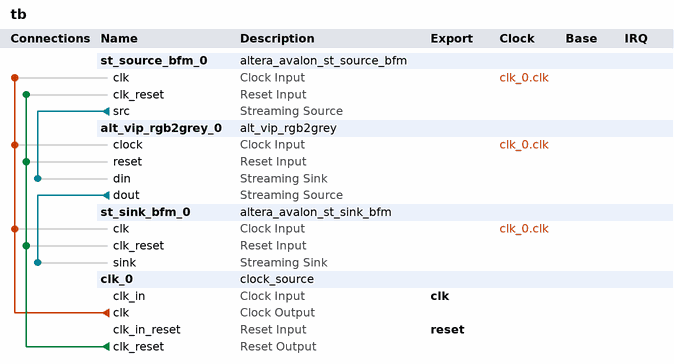
[diagram p0: system contents]
# Platform Designer (Qsys) system tb
# Parameters at their usual value, and those the tool derives, are not listed.
package require -exact qsys 12.0
create_system tb
set_project_property DEVICE_FAMILY STINGRAY

add_instance st_source_bfm_0 altera_avalon_st_source_bfm 12.0
set_instance_parameter_value st_source_bfm_0 USE_PACKET 1
set_instance_parameter_value st_source_bfm_0 USE_CHANNEL 0
set_instance_parameter_value st_source_bfm_0 USE_ERROR 0
set_instance_parameter_value st_source_bfm_0 USE_READY 1
set_instance_parameter_value st_source_bfm_0 USE_VALID 1
set_instance_parameter_value st_source_bfm_0 USE_EMPTY 0
set_instance_parameter_value st_source_bfm_0 ST_SYMBOL_W 8
set_instance_parameter_value st_source_bfm_0 ST_NUMSYMBOLS 3
set_instance_parameter_value st_source_bfm_0 ST_CHANNEL_W 1
set_instance_parameter_value st_source_bfm_0 ST_ERROR_W 1
set_instance_parameter_value st_source_bfm_0 ST_READY_LATENCY 1
set_instance_parameter_value st_source_bfm_0 ST_MAX_CHANNELS 0

add_instance alt_vip_rgb2grey_0 alt_vip_rgb2grey 1.0
set_instance_parameter_value alt_vip_rgb2grey_0 BITS_PER_SYMBOL 8
set_instance_parameter_value alt_vip_rgb2grey_0 SYMBOLS_PER_BEAT 3

add_instance st_sink_bfm_0 altera_avalon_st_sink_bfm 12.0
set_instance_parameter_value st_sink_bfm_0 USE_PACKET 1
set_instance_parameter_value st_sink_bfm_0 USE_CHANNEL 0
set_instance_parameter_value st_sink_bfm_0 USE_ERROR 0
set_instance_parameter_value st_sink_bfm_0 USE_READY 1
set_instance_parameter_value st_sink_bfm_0 USE_VALID 1
set_instance_parameter_value st_sink_bfm_0 USE_EMPTY 0
set_instance_parameter_value st_sink_bfm_0 ST_SYMBOL_W 8
set_instance_parameter_value st_sink_bfm_0 ST_NUMSYMBOLS 3
set_instance_parameter_value st_sink_bfm_0 ST_CHANNEL_W 1
set_instance_parameter_value st_sink_bfm_0 ST_ERROR_W 1
set_instance_parameter_value st_sink_bfm_0 ST_READY_LATENCY 1
set_instance_parameter_value st_sink_bfm_0 ST_MAX_CHANNELS 0

add_instance clk_0 clock_source 12.0
set_instance_parameter_value clk_0 clockFrequency 50000000
set_instance_parameter_value clk_0 resetSynchronousEdges DEASSERT

# connections
add_connection clk_0.clk alt_vip_rgb2grey_0.clock clock
add_connection clk_0.clk st_sink_bfm_0.clk clock
add_connection clk_0.clk st_source_bfm_0.clk clock
add_connection clk_0.clk_reset alt_vip_rgb2grey_0.reset reset
add_connection clk_0.clk_reset st_sink_bfm_0.clk_reset reset
add_connection clk_0.clk_reset st_source_bfm_0.clk_reset reset
add_connection alt_vip_rgb2grey_0.dout st_sink_bfm_0.sink avalon_streaming
add_connection st_source_bfm_0.src alt_vip_rgb2grey_0.din avalon_streaming

# exported interfaces
add_interface clk clock sink
set_interface_property clk EXPORT_OF clk_0.clk_in
add_interface reset reset sink
set_interface_property reset EXPORT_OF clk_0.clk_in_reset

save_system tb.qsys
